# EAGLE design encoder-testerB (EAGLE 6.6.0)
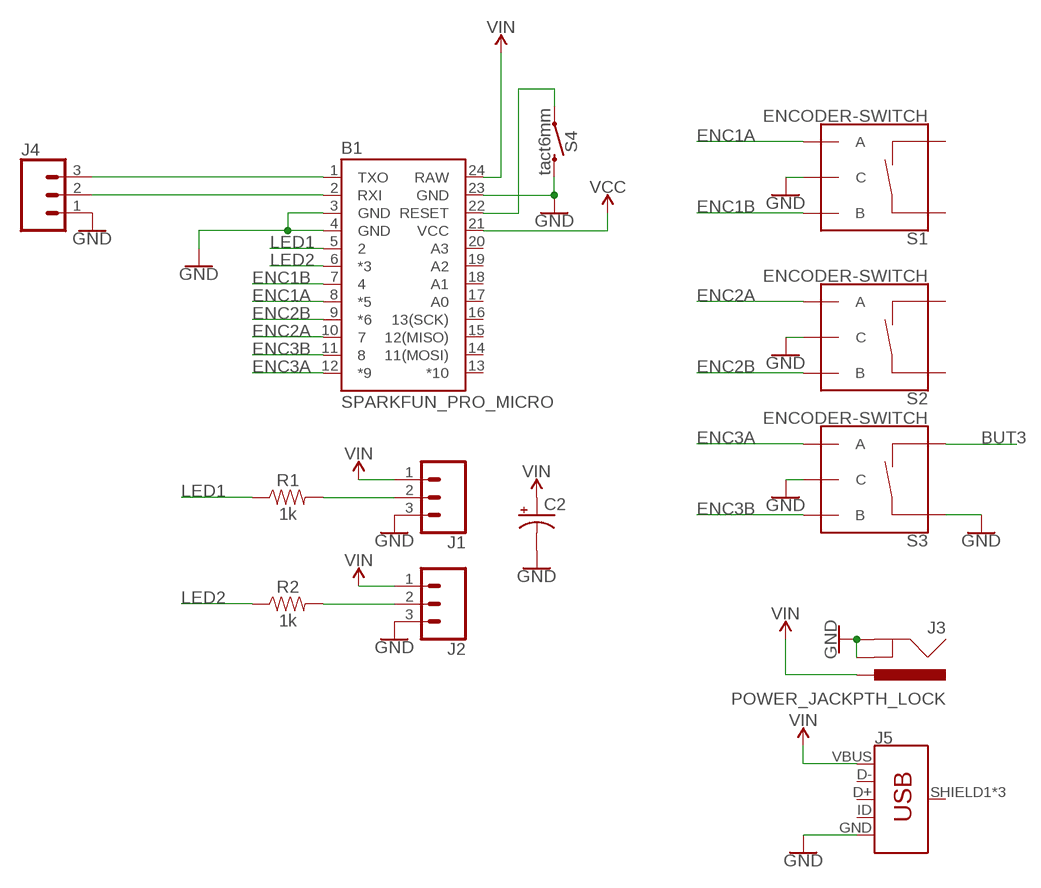
[diagram p0: schematic, sheet 1]

## Parts
B1  SPARKFUN_PRO_MICRO  [SPARKFUN_PRO_MICRO]
C2  CPOL-USE3.5-8  [E3,5-8]
J1  CONN_03  [1X03]
J2  CONN_03  [1X03]
J3  POWER_JACKPTH_LOCK  [POWER_JACK_PTH_LOCK]
J4  CONN_03  [1X03]
J5  USB_MICRO-B_FEMALE-SMT  [USB-B-MICRO-SMD]
R1  1k  1KOHM-HORIZ-1/4W-5%  [AXIAL-0.3]
R2  1k  1KOHM-HORIZ-1/4W-5%  [AXIAL-0.3]
S1  ENCODER-SWITCH  [ROTARY_ENC_PLAIN]
S2  ENCODER-SWITCH  [ROTARY_ENC_PLAIN]
S3  ENCODER-SWITCH  [ROTARY_ENC_PLAIN]
S4  tact6mm  MOMENTARY-SWITCH-SPST-PTH-6.0MM  [TACTILE_SWITCH_PTH_6.0MM]

## Nets
BUT3: S3.SW-
ENC1A: B1.8(*5) S1.A
ENC1B: B1.7 S1.B
ENC2A: B1.10 S2.A
ENC2B: B1.9(*6) S2.B
ENC3A: B1.12(*9) S3.A
ENC3B: B1.11 S3.B
GND: B1.3(GND) B1.4(GND) B1.23(GND) C2.- J1.3 J2.3 J3.GND J3.GNDBREAK J4.1 J5.GND S1.C S2.C S3.C S3.SW+ S4.3
LED1: B1.5 R1.P$1
LED2: B1.6(*3) R2.P$1
N$1: J1.2 R1.P$2
N$2: J2.2 R2.P$2
N$3: B1.2(RXI) J4.2
N$4: B1.1(TXO) J4.3
RESET: B1.22(RESET) S4.1
VCC: B1.21(VCC)
VIN: B1.24(RAW) C2.+ J1.1 J2.1 J3.PWR J5.VBUS
Unconnected: B1.13(*10) B1.14(11(MOSI)) B1.15(12(MISO)) B1.16(13(SCK)) B1.17(A0) B1.18(A1) B1.19(A2) B1.20(A3) J5.D+ J5.D- J5.ID J5.SHIELD1(SHIELD) J5.SHIELD2(SHIELD) J5.SHIELD3(SHIELD) S1.SW+ S1.SW- S2.SW+ S2.SW-

## Library data of the parts
B1 = SparkFun-Boards:SPARKFUN_PRO_MICRO: SparkFun Pro Micro Atmega32U4 compatible footprint. SparkFun Products: 3.3V/8MHz <https://www.sparkfun.com/products/12587> 5V/16MHz <https://www.sparkfun.com/products/12640>
C2 = adafruit:CPOL-US: POLARIZED CAPACITOR, American symbol
J1 J2 J4 = SparkFun-Connectors:CONN_03: Multi connection point. Often used as Generic Header-pin footprint for 0.1 inch spaced/style header connections On any of the 0.1 inch spaced packages, you can populate with these: Break Away Headers - Straight <https://www.sparkfun.com/products/116> (PRT-00116) Break Away Male Headers - Right Angle <https://www.sparkfun.com/products/553> (PRT-00553) Female Headers <https://www.sparkfun.com/products/115> (PRT-00115) Break Away Headers - Machine Pin <https://www.sparkfun.com/products/117> (PRT-00117) Break Away Female Headers - Swiss Machine Pin <https://www.sparkfun.com/products/743> (PRT-00743) Stackable Header - 3 Pin (Female, 0.1") <https://www.sparkfun.com/products/13875> (PRT-13875) For SCREWTERMINALS and SPRING TERMINALS visit here: Screw Terimnals on SparkFun.com <https://www.sparkfun.com/search/results?term=Screw+Terminals> (5mm/3.5mm/2.54mm spacing) This device is also useful as a general connection point to wire up your design to another part of your project. Our various solder wires solder well into these plated through hole pads. Hook-Up Wire - Assortment (Stranded, 22 AWG) <https://www.sparkfun.com/products/11375> (PRT-11375) Hook-Up Wire - Assortment (Solid Core, 22 AWG) <https://www.sparkfun.com/products/11367> (PRT-11367) View the entire wire category on our website here <https://www.sparkfun.com/categories/141> Special notes: Molex polarized connector foot print use with SKU : PRT-08232 with associated crimp pins and housings.
J3 = SparkFun-Connectors:POWER_JACK: Power Jack Connector This is the standard 5.5mm barrel jack for power. The PTH is the most common, proven, reliable, footprint. The Slot footprint only works if the mill layer is transmitted to the PCB fab house so be warned. Here are the connectors we sell at SparkFun: DC Barrel Power Jack/Connector <https://www.sparkfun.com/products/119> (PRT-00119) DC Barrel Power Jack/Connector (SMD) <https://www.sparkfun.com/products/12748> (PRT-12748) DC Barrel Jack Adapter - Breadboard Compatible <https://www.sparkfun.com/products/10811> (PRT-10811) It is used on this SparkFun product (and many, many others): SparkFun RedBoard - Programmed with Arduino <https://www.sparkfun.com/products/12757> (DEV-12757) Also, if you need a mating power supply or connector, please check these out: Wall Adapter Power Supply - 9VDC 650mA <https://www.sparkfun.com/products/298> (TOL-00298) DC Barrel Jack Adapter - Male <https://www.sparkfun.com/products/10287> (PRT-10287); PROD_ID: CONN-08197; SF_ID: PRT-00119
J5 = SparkFun-Connectors:USB_MICRO-B: USB Type Micro-B Connector Male/female and PTH/SMT variants SparkFun Products: SparkFun microB USB Breakout <https://www.sparkfun.com/products/12035> SparkFun USB microB Plug Breakout <https://www.sparkfun.com/products/10031> SparkFun ESP8266 Thing <https://www.sparkfun.com/products/13231>; PROD_ID: CONN-11752
R1 R2 = SparkFun-Resistors:1KOHM: 1kΩ resistor A resistor is a passive two-terminal electrical component that implements electrical resistance as a circuit element. Resistors act to reduce current flow, and, at the same time, act to lower voltage levels within circuits. - Wikipedia; PROD_ID: RES-08380
S1-S3 = SparkFun-Switches:ENCODER-SWITCH: Rotary Encoder w/ Select Switch Encoders rotate similarly to potentiometers, but they’re different from potentiometers in that an encoder has full rotation without limits. They output gray code so that you can tell how much and in which direction the encoder has been turned. This encoder includes a push-down select switch built into the shaft. SparkFun Products Rotary Encoder <https://www.sparkfun.com/products/9117> (COM-09117); SF_SKU: COM-09117
S4 = SparkFun-Switches:MOMENTARY-SWITCH-SPST: Momentary Switch (Pushbutton) - SPST Normally-open (NO) SPST momentary switches (buttons, pushbuttons). Variants PTH-12MM - 12mm square, through-hole Momentary Pushbutton Switch - 12mm Square <https://www.sparkfun.com/products/9190> (COM-09190) PTH-6.0MM, PTH-6.0MM-KIT - 6.0mm square, through-hole Mini Pushbutton Switch <https://www.sparkfun.com/products/97> (COM-00097) KIT package intended for soldering kit's - only one side of pads' copper is exposed. PTH-RIGHT-ANGLE-KIT - Right-angle, through-hole Right Angle Tactile Button <https://www.sparkfun.com/products/10791> - Used on SparkFun BigTime Watch Kit <https://www.sparkfun.com/products/11734> SMD-12MM - 12mm square, surface-mount Tactile Button - SMD (12mm) <https://www.sparkfun.com/products/12993> (COM-12993) Used on SparkFun PicoBoard <https://www.sparkfun.com/products/11888> SMD-4.5MM - 4.5mm Square Trackball Switch Used on SparkFun Blackberry Trackballer Breakout <https://www.sparkfun.com/products/13169> SMD-4.6MMX2.8MM - 4.60mm x 2.80mm, surface mount Used on SparkFun SAMD21 Mini Breakout <https://www.sparkfun.com/products/13664> SMD-5.2MM, SMD-5.2-REDUNDANT - 5.2mm square, surface-mount Mini Pushbutton Switch - SMD <https://www.sparkfun.com/products/8720> (COM-08720) Used on Arduino Pro Mini <https://www.sparkfun.com/products/11114> REDUNDANT package connects both switch circuits together SMD-6.0X3.5MM - 6.0 x 3.5mm, surface mount Momentary Reset Switch SMD <https://www.sparkfun.com/products/8229> (COM-08229) SMD-6.2MM-TALL - 6.2mm square, surface mount Tactile Button - SMD (6mm) <https://www.sparkfun.com/products/12992> Used on SparkFun Digital Sandbox <https://www.sparkfun.com/products/12651> SMD-RIGHT-ANGLE - Right-angle, surface mount Used on SparkFun Block for Intel® Edison - Arduino <https://www.sparkfun.com/products/13036>; PROD_ID: SWCH-08441; SF_SKU: COM-00097

## Board
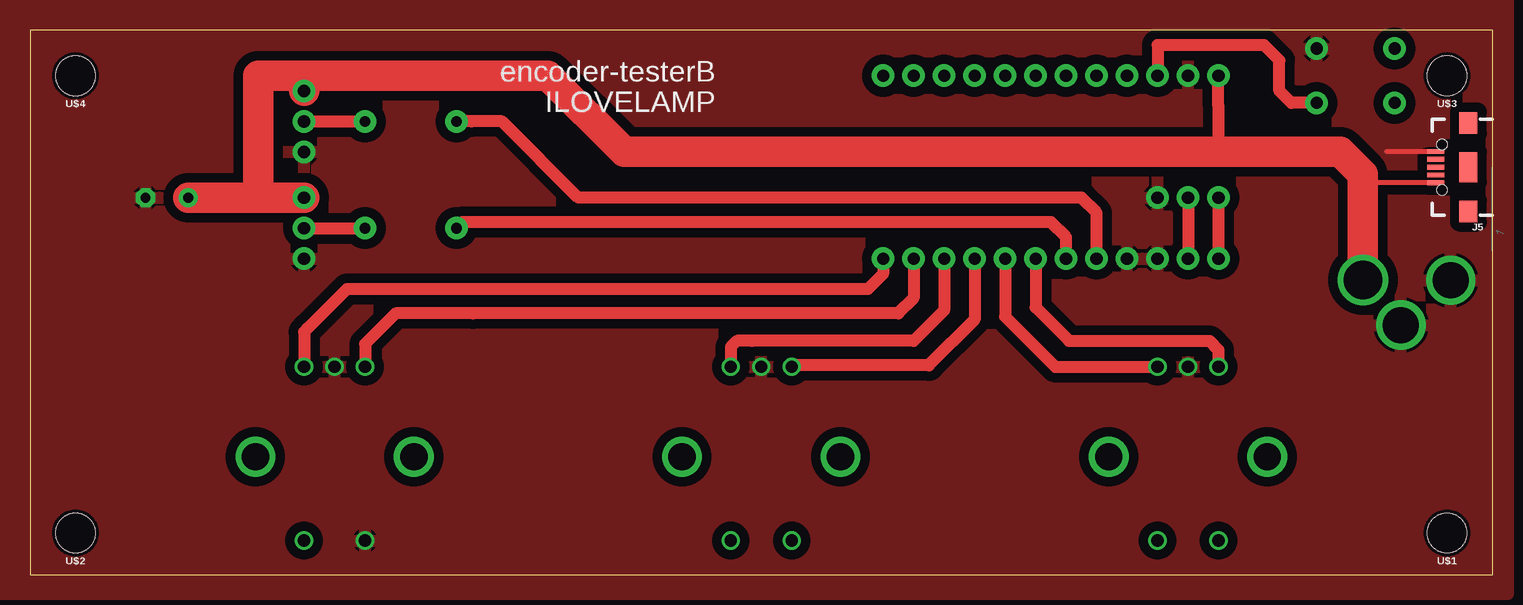
[diagram p1: board, top side]
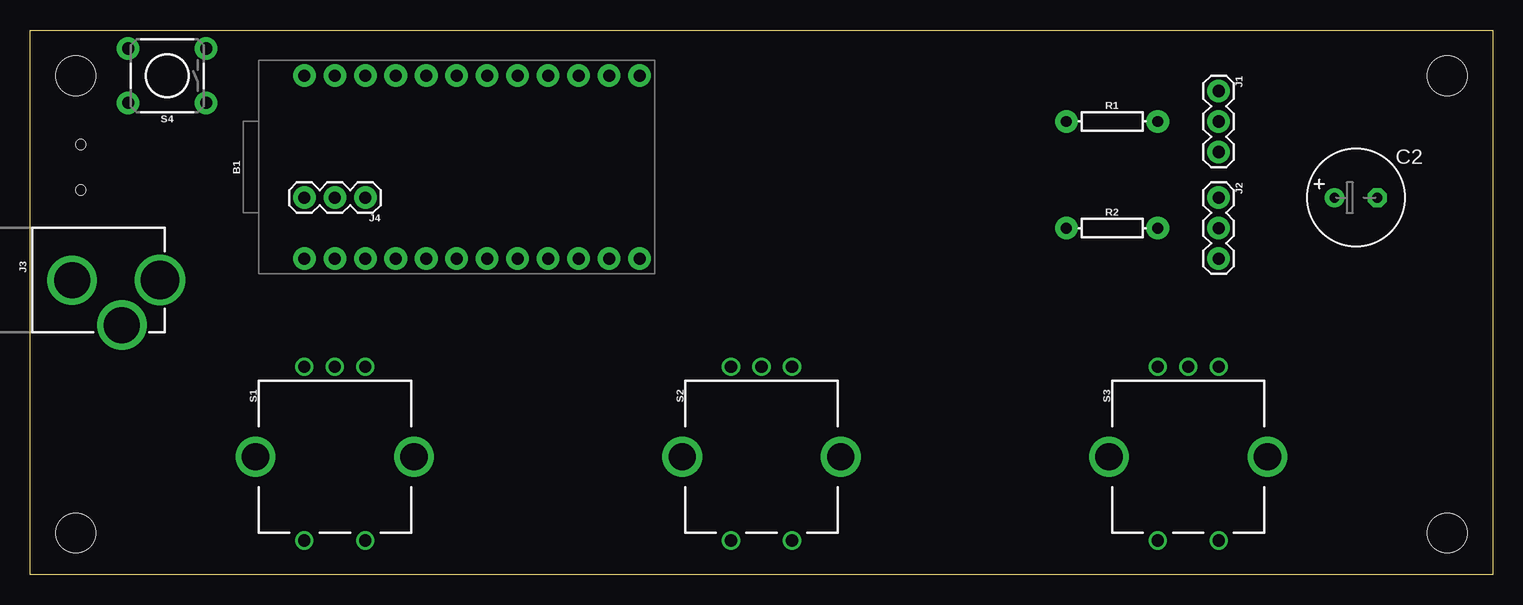
[diagram p2: board, bottom side, seen from below]

Size 121.9 x 45.39 mm. Coordinates in mm from the lower left corner, seen from the top.
Outline: 121.9,45.39 0,45.39 0,0 121.9,0 121.9,45.39
Copper layers (1*16): Top 0.035mm / dielectric 1.5mm / Bottom 0.035mm
Design rules "OthermillDRC_1_32_v2": minimum track width 8mil, minimum drill 0.8mm, track to track 0.794003125mm, track to pad 0.794003125mm, pad to pad 0.794003125mm, via to via 0.794003125mm, smd to smd 0mil, copper to edge 0mil, drill to drill 1mil, minimum pad ring 10mil, minimum via ring 10mil, stop-mask expansion 1mil, vias tented up to drill 30mil, thermal gap 10mil

### Footprints (pad centres in the part's own frame; a part is rotated, then mirrored left to right if it is on the bottom)
SPARKFUN_PRO_MICRO = drill 1.016 pad 1.88: 1 -7.62,12.7; 2 -7.62,10.16; 3 -7.62,7.62; 4 -7.62,5.08; 5 -7.62,2.54; 6 -7.62,0; 7 -7.62,-2.54; 8 -7.62,-5.08; 9 -7.62,-7.62; 10 -7.62,-10.16; 11 -7.62,-12.7; 12 -7.62,-15.24; 13 7.62,-15.24; 14 7.62,-12.7; 15 7.62,-10.16; 16 7.62,-7.62; 17 7.62,-5.08; 18 7.62,-2.54; 19 7.62,0; 20 7.62,2.54; 21 7.62,5.08; 22 7.62,7.62; 23 7.62,10.16; 24 7.62,12.7
E3,5-8 = drill 0.813 pad 1.6: + -1.778,0 | drill 0.813 pad 1.6 octagon: - 1.778,0
1X03 = drill 1.016 pad 1.88: 1 0,0; 2 2.54,0; 3 5.08,0
POWER_JACK_PTH_LOCK = drill 2.997 pad 4.115: GND 0.025,6.557; GNDBREAK 3.762,10.7 | drill 3.2 pad 4.115: PWR 0,13.878
USB-B-MICRO-SMD = smd 1.45 x 0.4: D+ 2.725,0; D- 2.725,0.65; GND 2.725,-1.3; ID 2.725,-0.65; VBUS 2.725,1.3 | smd 1.5 x 1.8: SHIELD1 0,3.685; SHIELD2 0,-3.685 | smd 1.5 x 2.5: SHIELD3 0,0 | hole 0.85: 2.2,1.9; 2.2,-1.9
AXIAL-0.3 = drill 0.9 pad 1.88: P$1 -3.81,0; P$2 3.81,0
ROTARY_ENC_PLAIN = drill 1.016: A 7.493,-2.54; B 7.493,2.54; C 7.493,0; SW+ -6.985,2.54; SW- -6.985,-2.54 | drill 2.286: P$3 0,6.604; P$4 0,-6.604
TACTILE_SWITCH_PTH_6.0MM = drill 1.016 pad 1.88: 1 -3.251,2.261; 2 3.251,2.261; 3 -3.251,-2.261; 4 3.251,-2.261
STAND-OFF = hole 3.302: 0,0

### Placement (x,y rotation side)
B1  86.34,33.96 90 bottom
C2  11.41,31.42 0 bottom
J1  22.84,40.31 270 bottom
J2  22.84,31.42 270 bottom
J3  124.95,24.56 270 bottom
J4  93.96,31.42 180 bottom
J5  119.87,33.96 180 top
R1  31.73,37.77 0 bottom
R2  31.73,28.88 0 bottom
S1  96.5,9.83 90 bottom
S2  60.94,9.83 90 bottom
S3  25.38,9.83 90 bottom
S4  110.47,41.58 180 bottom
U$1  [STAND-OFF]  118.09,3.48 180 top
U$2  [STAND-OFF]  3.79,3.48 180 top
U$3  [STAND-OFF]  118.09,41.58 180 top
U$4  [STAND-OFF]  3.79,41.58 180 top

### Tracks (layer width: path | path; a pad name or v marks a point on that pad's centre or on a via)
ENC1A
  Top 1.016: 93.96,17.45 S1.A 85.45,17.32 81.26,21.51 B1.8
ENC1B
  Top 1.016: B1.7 83.8,22.28 86.59,19.48 90.4,19.48 98.28,19.48 99.04,18.72 S1.B
ENC2A
  Top 1.016: B1.10 76.18,22.02 73.64,19.48 60.18,19.48 58.91,19.48 58.4,18.97 S2.A
ENC2B
  Top 1.016: B1.9 78.72,21.26 74.91,17.45 63.61,17.45 S2.B
ENC3A
  Top 1.016: B1.12 71.1,25.07 69.83,23.8 33.13,23.8 26.4,23.8 23.09,20.5 22.84,20.24 S3.A
ENC3B
  Top 1.016: B1.11 73.64,23.04 72.37,21.77 36.94,21.77 30.46,21.77 27.92,19.23 S3.B
GND
  Top 0.254: 113.04,35.26 113.01,35.23
  Top 0.406: J5.GND 113.04,35.26
  pour Top: -3.83,-1.6 123.17,-1.6 123.17,47.93 -3.83,47.93
LED1
  Top 1.016: B1.5 88.88,30.15 87.61,31.42 45.7,31.42 39.35,37.77 36.81,37.77 R1.P$1
LED2
  Top 1.016: B1.6 86.34,28.12 85.07,29.39 36.05,29.39 R2.P$1
N$1
  Top 1.016: J1.2 R1.P$2
N$2
  Top 1.016: J2.2 R2.P$2
N$3
  Top 1.016: J4.2 B1.2
N$4
  Top 1.016: J4.3 B1.1
RESET
  Top 1.016: S4.1 106.94,39.32 105.11,39.32 104.12,40.31 104.12,42.85 102.85,44.12 102.14,44.12 101.58,44.12 93.96,44.12 B1.22
VIN
  Top 0.254: 111.1,32.66 111.07,32.69
  Top 0.406: J5.VBUS 111.1,32.66
  Top 1.016: B1.24 99.04,39.04 99.04,35.23
  Top 2.54: J3.PWR 111.07,32.69 111.07,33.36 109.2,35.23 104.12,35.23 99.04,35.23 63.48,35.23 49.51,35.23 43.16,41.58 24.11,41.58 22.84,41.58 | 19.03,31.42 19.03,40.31 19.03,41.58 22.84,41.58 | 19.03,31.42 J2.1 | 19.03,31.42 C2.+ | J1.1 22.84,41.58

### Text on the board
tPlace: encoder-testerB | ILOVELAMP